# Altium schematic sheet [09] USB-DFU.SchDoc
size A4; SheetNumber: 9
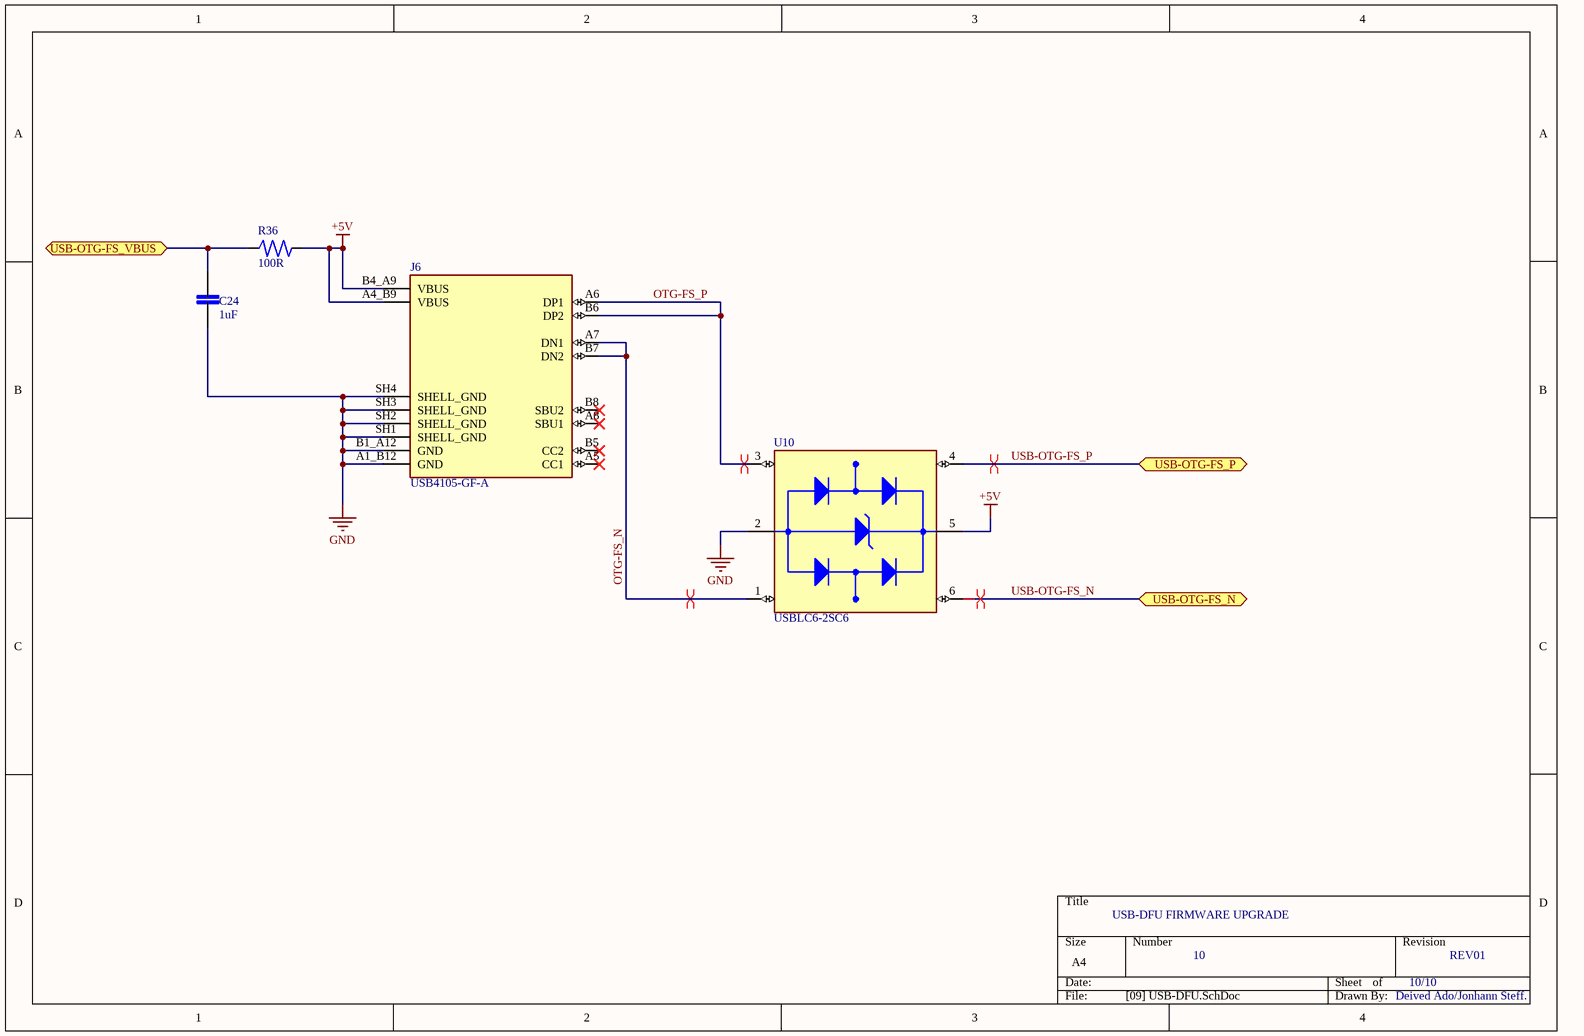
[diagram p0: [09] USB-DFU.SchDoc]

## Parts
C24  1uF  [CAP_0603]
J6  USB4105-GF-A  [GCT_USB4105-GF-A]
R36  100R  [RES_0603]
U10  USBLC6-2SC6  [SOT95P280X145-6N]

## Ports
USB-OTG-FS_N (bidir), USB-OTG-FS_P (bidir), USB-OTG-FS_VBUS

## Nets
+5V: J6.A4_B9(VBUS) J6.B4_A9(VBUS) R36.1 U10.5(VBUS)
GND: C24.1 J6.A1_B12(GND) J6.B1_A12(GND) J6.SH1(SHELL_GND) J6.SH2(SHELL_GND) J6.SH3(SHELL_GND) J6.SH4(SHELL_GND) U10.2(GND)
OTG-FS_N: J6.A7(DN1) J6.B7(DN2) U10.1(I/O1_IN)
OTG-FS_P: J6.A6(DP1) J6.B6(DP2) U10.3(I/O2_IN)
USB-OTG-FS_N: U10.6(I/O1_OUT) ; port USB-OTG-FS_N
USB-OTG-FS_P: U10.4(I/O2_OUT) ; port USB-OTG-FS_P
USB-OTG-FS_VBUS: C24.2 R36.2 ; port USB-OTG-FS_VBUS

Not connected (* = marked no-connect by the designer): J6 A5(CC1)* A8(SBU1)* B5(CC2)* B8(SBU2)*

## Layout directives
differential pair: OTG-FS_N, OTG-FS_P, USB-OTG-FS_N, USB-OTG-FS_P

## Notes on the sheet
- USB-DFU FIRMWARE UPGRADE
- 10
- 10/10
- REV01
- Deived Ado/Jonhann Steff.

## Library data of the parts
C24 = C_Small: Generic capacitor symbol
J6 = USB4105-GF-A: USB-C (USB TYPE-C) USB 2.0 Receptacle Connector 24 (16+8 Dummy) Position Surface Mount, Right Angle; Through Hole; MF: GCT; SnapEDA_Link: https://www.snapeda.com/parts/USB4105-GF-A/Global+Connector+Technology/view-part/?ref=snap; Package: None; Value: *; MP: USB4105-GF-A; Check_prices: https://www.snapeda.com/parts/USB4105-GF-A/Global+Connector+Technology/view-part/?ref=eda
R36 = R_Small: Generic Resistor symbol
U10 = USBLC6-2SC6: 17V Clamp 5A (8/20Âµs) Ipp Tvs Diode Surface Mount SOT-23-6; MF: STMicroelectronics; Value: *; SnapEDA_Link: https://www.snapeda.com/parts/USBLC6-2SC6/STMicroelectronics/view-part/?ref=snap; Check_prices: https://www.snapeda.com/parts/USBLC6-2SC6/STMicroelectronics/view-part/?ref=eda; Purchase-URL: https://pricing.snapeda.com/search/part/USBLC6-2SC6/?ref=eda; Price: None; Availability: In Stock; Package: SOT-23-6 STMicroelectronics; MP: USBLC6-2SC6